# Altium project MasterProcessor.PrjPCB
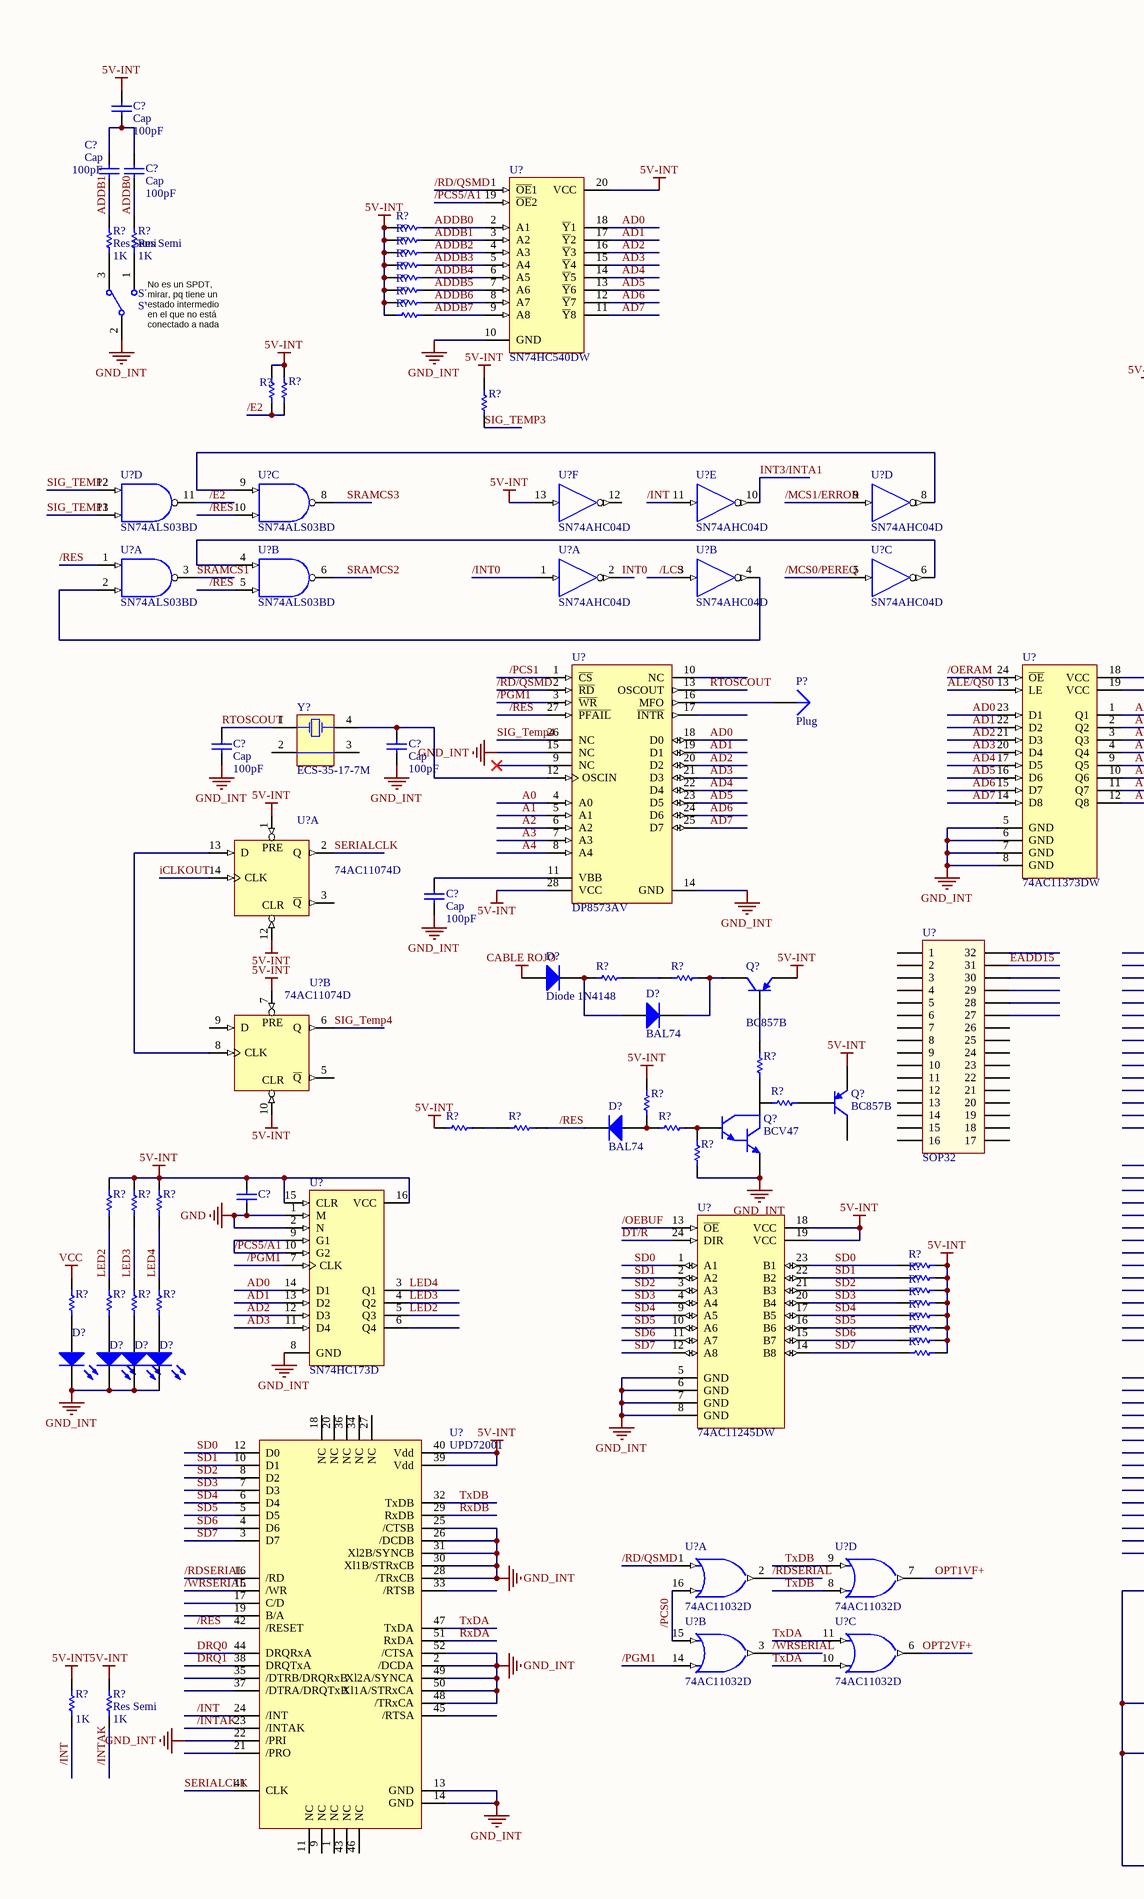
[diagram p0: Master_Processor.SchDoc, left]
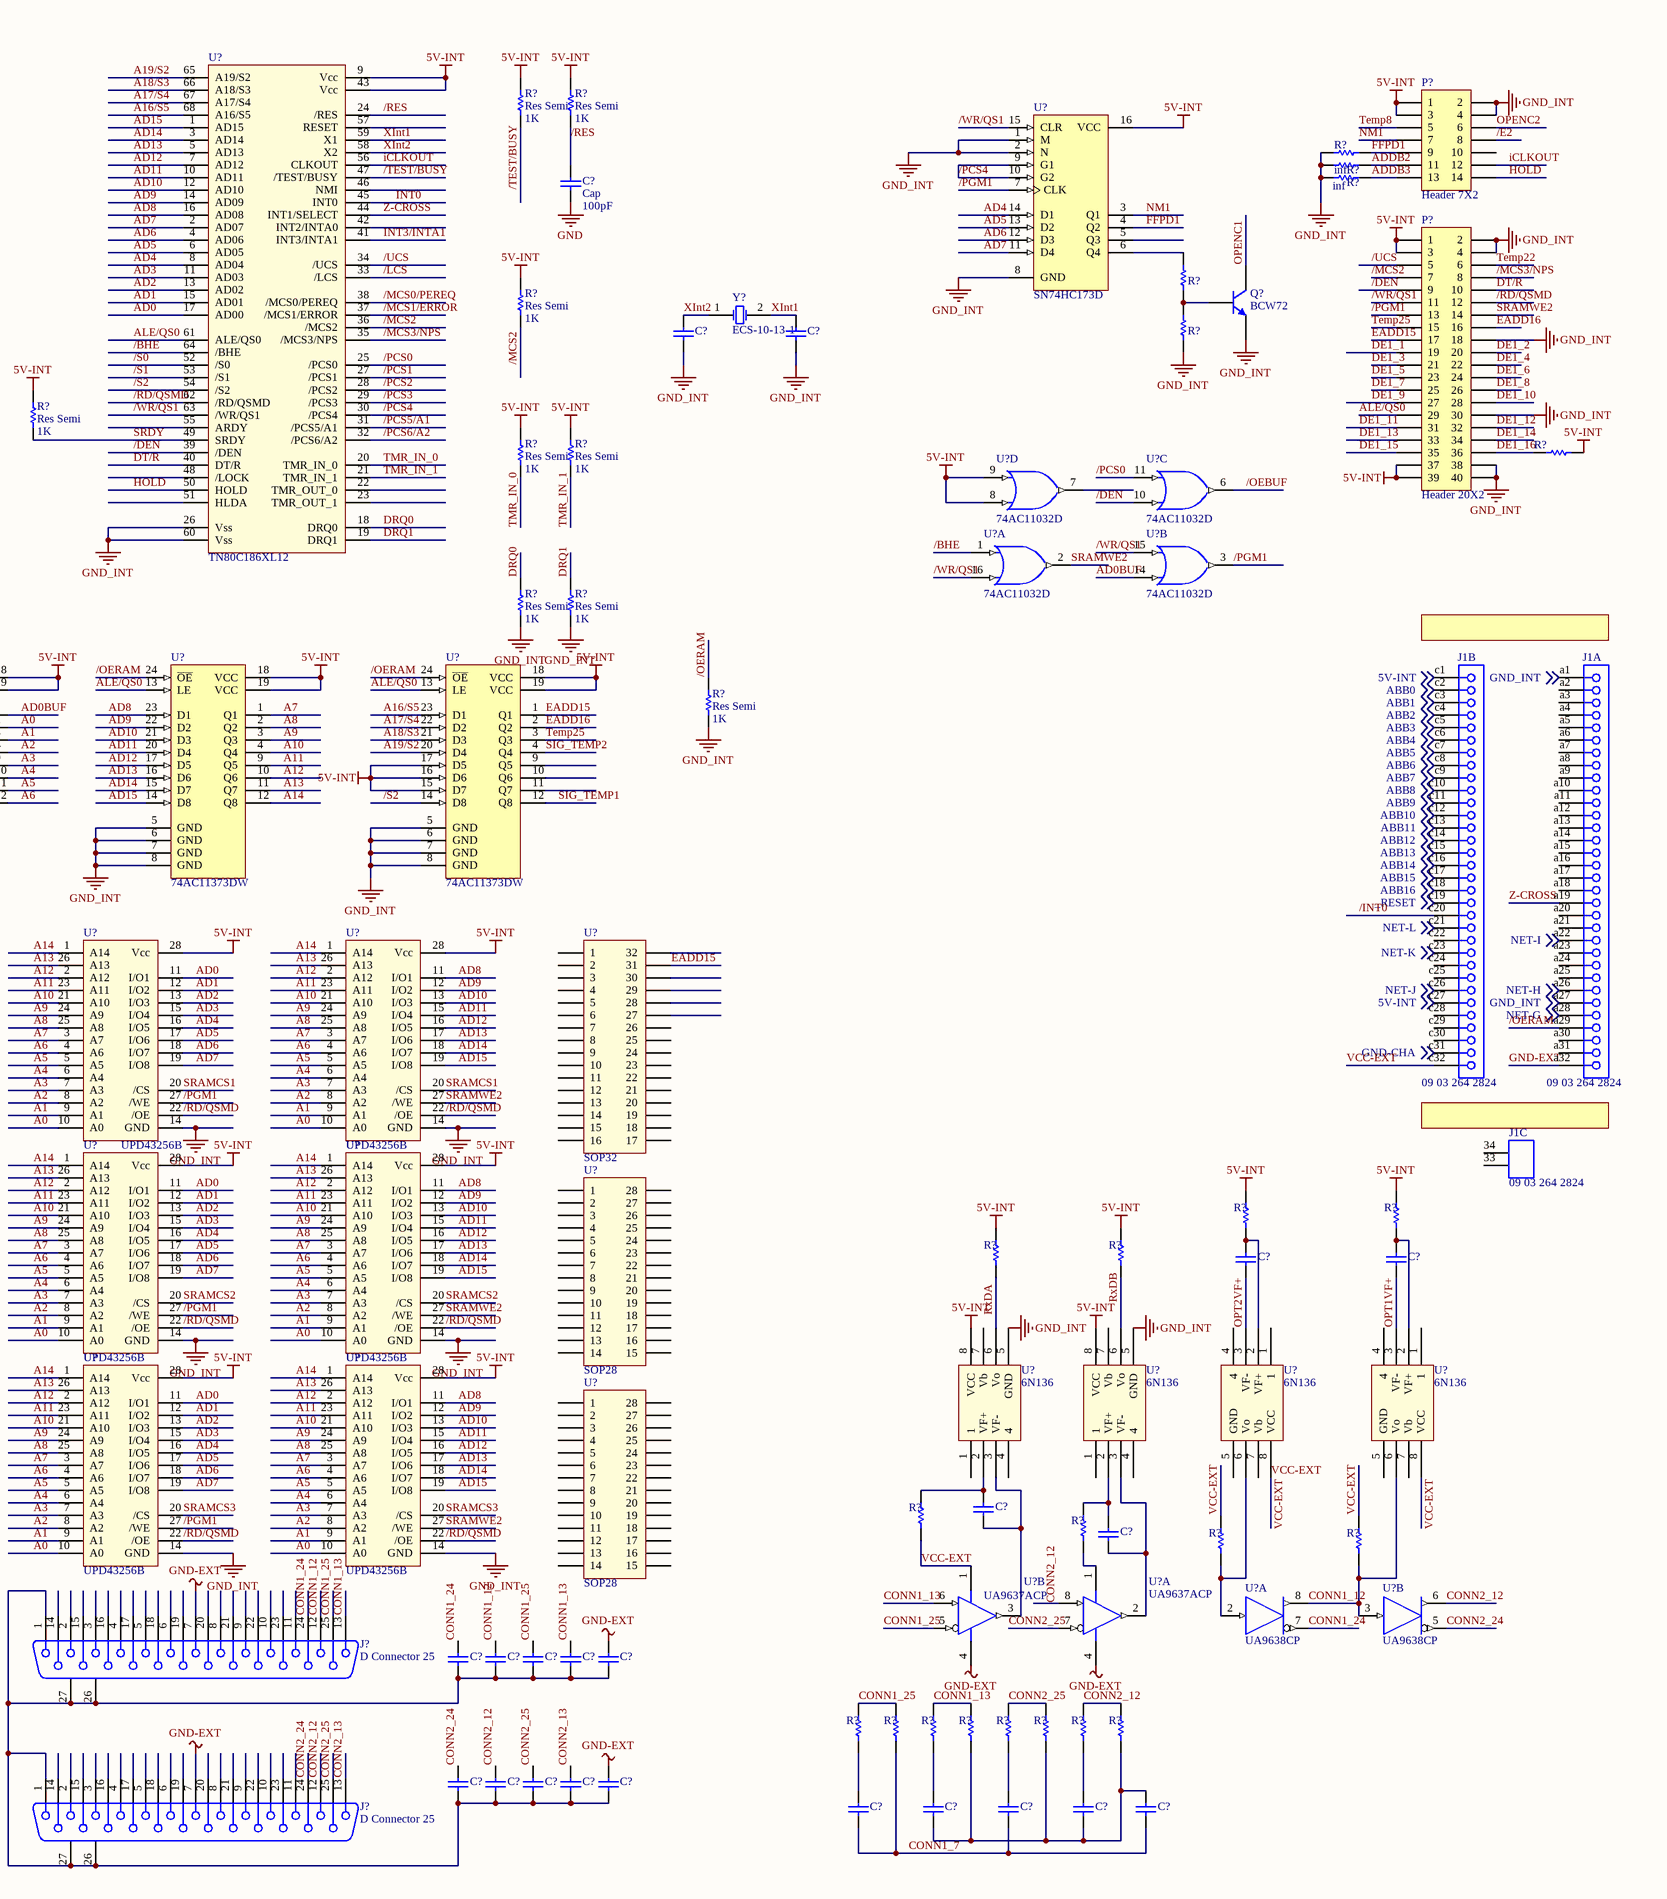
[diagram p1: Master_Processor.SchDoc, right]
1 sheet, 167 parts. Net scope: global (net labels, ports and power ports of the same name join across sheets).

## Sheet Master_Processor.SchDoc
size A2

### Parts
(Parts that share a designator on the sheet are numbered #1, #2 ... from top to bottom, then left to right.)
C?#1  Cap  value 100pF  [RAD-0.3]
C?#2  Cap  value 100pF  [RAD-0.3]
C?#3  Cap  value 100pF  [RAD-0.3]
C?#4  Cap  value 100pF  [RAD-0.3]
C?#5  Cap  [RAD-0.3]  (value not drawn)
C?#6  Cap  [RAD-0.3]  (value not drawn)
C?#7  Cap  value 100pF  [RAD-0.3]
C?#8  Cap  value 100pF  [RAD-0.3]
C?#9  Cap  value 100pF  [RAD-0.3]
C?#10  Cap  [RAD-0.3]  (value not drawn)
C?#11  Cap  [RAD-0.3]  (value not drawn)
C?#12  Cap  [RAD-0.3]  (value not drawn)
C?#13  Cap  [RAD-0.3]  (value not drawn)
C?#14  Cap  [RAD-0.3]  (value not drawn)
C?#15  Cap  [RAD-0.3]  (value not drawn)
C?#16  Cap  [RAD-0.3]  (value not drawn)
C?#17  Cap  [RAD-0.3]  (value not drawn)
C?#18  Cap  [RAD-0.3]  (value not drawn)
C?#19  Cap  [RAD-0.3]  (value not drawn)
C?#20  Cap  [RAD-0.3]  (value not drawn)
C?#21  Cap  [RAD-0.3]  (value not drawn)
C?#22  Cap  [RAD-0.3]  (value not drawn)
C?#23  Cap  [RAD-0.3]  (value not drawn)
C?#24  Cap  [RAD-0.3]  (value not drawn)
C?#25  Cap  [RAD-0.3]  (value not drawn)
C?#26  Cap  [RAD-0.3]  (value not drawn)
C?#27  Cap  [RAD-0.3]  (value not drawn)
C?#28  Cap  [RAD-0.3]  (value not drawn)
C?#29  Cap  [RAD-0.3]  (value not drawn)
D?#1  Diode 1N4148  [DO-35]
D?#2  BAL74  [SOT-23]
D?#3  BAL74  [SOT-23]
D?#4  LED0  [LED-0]  (value not drawn)
D?#5  LED0  [LED-0]  (value not drawn)
D?#6  LED0  [LED-0]  (value not drawn)
D?#7  LED0  [LED-0]  (value not drawn)
J1  09 03 264 2824  [0903264x824]  (parts A,B,C of 3)
J?#1  D Connector 25  [DSUB1.385-2H25A]
J?#2  D Connector 25  [DSUB1.385-2H25A]
P?#1  Header 7X2  [HDR2X7]
P?#2  Header 20X2  [HDR2X20]
P?#3  Plug  [PIN1]
Q?#1  BCW72  [SOT23]
Q?#2  BC857B  [SOT23_N]
Q?#3  BC857B  [SOT23_N]
Q?#4  BCV47  [SOT23_N]
R?#1  Res Semi  value 1K  [AXIAL-0.5]
R?#2  Res Semi  value 1K  [AXIAL-0.5]
R?#3  value inf  [RES0805]  (hidden comment: Res)
R?#4  value inf  [RES0805]  (hidden comment: Res)
R?#5  Res  [RES0805]  (value not drawn)
R?#6  Res Semi  [AXIAL-0.5]  (value not drawn)
R?#7  Res Semi  value 1K  [AXIAL-0.5]
R?#8  Res Semi  value 1K  [AXIAL-0.5]
R?#9  Res Semi  [AXIAL-0.5]  (value not drawn)
R?#10  Res Semi  [AXIAL-0.5]  (value not drawn)
R?#11  Res  [RES0805]  (value not drawn)
R?#12  Res Semi  [AXIAL-0.5]  (value not drawn)
R?#13  Res Semi  [AXIAL-0.5]  (value not drawn)
R?#14  Res Semi  [AXIAL-0.5]  (value not drawn)
R?#15  Res Semi  [AXIAL-0.5]  (value not drawn)
R?#16  Res Semi  value 1K  [AXIAL-0.5]
R?#17  Res  [RES0805]  (value not drawn)
R?#18  Res Semi  [AXIAL-0.5]  (value not drawn)
R?#19  Res Semi  [AXIAL-0.5]  (value not drawn)
R?#20  Res Semi  [AXIAL-0.5]  (value not drawn)
R?#21  Res Semi  [AXIAL-0.5]  (value not drawn)
R?#22  Res Semi  value 1K  [AXIAL-0.5]
R?#23  Res  [RES0805]  (value not drawn)
R?#24  Res Semi  value 1K  [AXIAL-0.5]
R?#25  Res Semi  value 1K  [AXIAL-0.5]
R?#26  Res Semi  value 1K  [AXIAL-0.5]
R?#27  Res Semi  value 1K  [AXIAL-0.5]
R?#28  Res Semi  value 1K  [AXIAL-0.5]
R?#29  Res Semi  [AXIAL-0.5]  (value not drawn)
R?#30  Res Semi  [AXIAL-0.5]  (value not drawn)
R?#31  Res Semi  [AXIAL-0.5]  (value not drawn)
R?#32  Res Semi  [AXIAL-0.5]  (value not drawn)
R?#33  Res Semi  [AXIAL-0.5]  (value not drawn)
R?#34  Res Semi  [AXIAL-0.5]  (value not drawn)
R?#35  Res Semi  [AXIAL-0.5]  (value not drawn)
R?#36  Res Semi  [AXIAL-0.5]  (value not drawn)
R?#37  Res Semi  [AXIAL-0.5]  (value not drawn)
R?#38  Res Semi  [AXIAL-0.5]  (value not drawn)
R?#39  Res Semi  [AXIAL-0.5]  (value not drawn)
R?#40  Res Semi  [AXIAL-0.5]  (value not drawn)
R?#41  Res Semi  [AXIAL-0.5]  (value not drawn)
R?#42  Res Semi  [AXIAL-0.5]  (value not drawn)
R?#43  Res Semi  [AXIAL-0.5]  (value not drawn)
R?#44  Res Semi  [AXIAL-0.5]  (value not drawn)
R?#45  Res Semi  [AXIAL-0.5]  (value not drawn)
R?#46  Res Semi  [AXIAL-0.5]  (value not drawn)
R?#47  Res Semi  [AXIAL-0.5]  (value not drawn)
R?#48  Res Semi  [AXIAL-0.5]  (value not drawn)
R?#49  Res Semi  [AXIAL-0.5]  (value not drawn)
R?#50  Res Semi  [AXIAL-0.5]  (value not drawn)
R?#51  Res Semi  [AXIAL-0.5]  (value not drawn)
R?#52  Res Semi  [AXIAL-0.5]  (value not drawn)
R?#53  Res Semi  [AXIAL-0.5]  (value not drawn)
R?#54  Res Semi  [AXIAL-0.5]  (value not drawn)
R?#55  Res Semi  [AXIAL-0.5]  (value not drawn)
R?#56  Res Semi  [AXIAL-0.5]  (value not drawn)
R?#57  Res Semi  [AXIAL-0.5]  (value not drawn)
R?#58  Res Semi  [AXIAL-0.5]  (value not drawn)
R?#59  Res Semi  [AXIAL-0.5]  (value not drawn)
R?#60  Res Semi  [AXIAL-0.5]  (value not drawn)
R?#61  value 1K  [AXIAL-0.5]  (hidden comment: Res Semi)
R?#62  Res Semi  value 1K  [AXIAL-0.5]
R?#63  Res Semi  [AXIAL-0.5]  (value not drawn)
R?#64  Res Semi  [AXIAL-0.5]  (value not drawn)
R?#65  Res Semi  [AXIAL-0.5]  (value not drawn)
R?#66  Res Semi  [AXIAL-0.5]  (value not drawn)
R?#67  Res Semi  [AXIAL-0.5]  (value not drawn)
R?#68  Res Semi  [AXIAL-0.5]  (value not drawn)
R?#69  Res Semi  [AXIAL-0.5]  (value not drawn)
R?#70  Res Semi  [AXIAL-0.5]  (value not drawn)
S?  SW-SPDT  [TL36WW15050]
U?#1  SN74HC173D  [D016_N]
U?#2  SN74HC540DW  [DW020_N]
U?#3  TN80C186XL12
U?#4  74AC11032D  [D016_N]  (part D of 4)
U?#5  74AC11032D  [D016_N]  (part C of 4)
U?#6  SN74ALS03BD  [D014_N]  (part D of 4)
U?#7  SN74ALS03BD  [D014_N]  (part C of 4)
U?#8  SN74AHC04D  [D014_N]  (part F of 6)
U?#9  SN74AHC04D  [D014_N]  (part E of 6)
U?#10  SN74AHC04D  [D014_N]  (part D of 6)
U?#11  74AC11032D  [D016_N]  (part A of 4)
U?#12  74AC11032D  [D016_N]  (part B of 4)
U?#13  SN74ALS03BD  [D014_N]  (part A of 4)
U?#14  SN74ALS03BD  [D014_N]  (part B of 4)
U?#15  SN74AHC04D  [D014_N]  (part A of 6)
U?#16  SN74AHC04D  [D014_N]  (part B of 6)
U?#17  SN74AHC04D  [D014_N]  (part C of 6)
U?#18  DP8573AV  [V28A_L]
U?#19  74AC11373DW  [DW024_N]
U?#20  74AC11373DW  [DW024_N]
U?#21  74AC11373DW  [DW024_N]
U?#22  74AC11074D  [D014_N]  (part A of 2)
U?#23  SOP32
U?#24  UPD43256B
U?#25  UPD43256B
U?#26  SOP32
U?#27  74AC11074D  [D014_N]  (part B of 2)
U?#28  UPD43256B
U?#29  UPD43256B
U?#30  SN74HC173D  [D016_N]
U?#31  SOP28
U?#32  74AC11245DW  [DW024_N]
U?#33  6N136
U?#34  6N136
U?#35  UPD43256B
U?#36  UPD43256B
U?#37  SOP28
U?#38  6N136
U?#39  6N136
U?#40  74AC11032D  [D016_N]  (part A of 4)
U?#41  74AC11032D  [D016_N]  (part D of 4)
U?#42  UA9637ACP  [P008]  (part B of 2)
U?#43  UA9637ACP  [P008]  (part A of 2)
U?#44  UA9638CP  [P008]  (part A of 2)
U?#45  UA9638CP  [P008]  (part B of 2)
U?#46  UPD72001
U?#47  74AC11032D  [D016_N]  (part B of 4)
U?#48  74AC11032D  [D016_N]  (part C of 4)
Y?#1  ECS-10-13-1  [HC-49U]
Y?#2  ECS-35-17-7M  [ECX-3M]

### Nets
5V-INT: C?#1.2 C?#10.2 J1.c1 J1.c27 P?#1.1 P?#1.3 P?#2.1 P?#2.3 P?#2.37 P?#2.39 Q?#2.2(E) Q?#3.2(E) R?#1.2 R?#2.2 R?#6.2 R?#9.2 R?#10.2 R?#12.2 R?#13.2 R?#14.2 R?#15.2 R?#16.2 R?#18.2 R?#19.2 R?#20.2 R?#21.2 R?#22.2 R?#23.2 R?#24.2 R?#25.2 R?#32.1 R?#35.2 R?#38.2 R?#39.2 R?#40.2 R?#41.2 R?#42.2 R?#43.2 R?#44.2 R?#45.1 R?#46.1 R?#47.1 R?#52.1 R?#53.1 R?#54.1 R?#55.1 R?#56.1 R?#61.2 R?#62.2 U?#1.16(VCC) U?#2.20(VCC) U?#3.9(Vcc) U?#3.43(Vcc) U?#4.8(B) U?#4.9(A) U?#8.13(A) U?#18.28(VCC) U?#19.18(VCC) U?#19.19(VCC) U?#20.18(VCC) U?#20.19(VCC) U?#21.15(D7) U?#21.16(D6) U?#21.17(D5) U?#21.18(VCC) U?#21.19(VCC) U?#22.1(PRE) U?#22.12(CLR) U?#24.28(Vcc) U?#25.28(Vcc) U?#27.7(PRE) U?#27.10(CLR) U?#28.28(Vcc) U?#29.28(Vcc) U?#30.15(CLR) U?#30.16(VCC) U?#32.18(VCC) U?#32.19(VCC) U?#35.28(Vcc) U?#36.28(Vcc) U?#38.8(VCC) U?#39.8(VCC) U?#46.39(Vdd) U?#46.40(Vdd) ; off-sheet 5V-INT
CABLE ROJO: D?#1.1(A)
GND: C?#4.2 C?#10.1 U?#4.4(GND) U?#4.5(GND) U?#5.4(GND) U?#5.5(GND) U?#6.7(GND) U?#7.7(GND) U?#8.7(GND) U?#9.7(GND) U?#10.7(GND) U?#11.4(GND) U?#11.5(GND) U?#12.4(GND) U?#12.5(GND) U?#13.7(GND) U?#14.7(GND) U?#15.7(GND) U?#16.7(GND) U?#17.7(GND) U?#22.4(GND) U?#27.4(GND) U?#30.1(M) U?#30.2(N) U?#40.4(GND) U?#40.5(GND) U?#41.4(GND) U?#41.5(GND) U?#44.4(GND) U?#45.4(GND) U?#47.4(GND) U?#47.5(GND) U?#48.4(GND) U?#48.5(GND)
GND-EXT: C?#19.2 C?#24.2 J1.a32 J?#1.7 J?#2.7 U?#42.4(GND) U?#43.4(GND)
GND_INT: C?#5.1 C?#6.1 C?#7.2 C?#8.2 C?#9.2 D?#4.2(K) D?#5.2(K) D?#6.2(K) D?#7.2(K) J1.a1 J1.a27 P?#1.2 P?#1.4 P?#2.2 P?#2.4 P?#2.18 P?#2.30 P?#2.38 P?#2.40 Q?#1.2(E) Q?#4.2(E) R?#3.1 R?#4.1 R?#5.2 R?#17.2 R?#26.1 R?#27.1 R?#28.1 R?#37.1 S?.2 U?#1.1(M) U?#1.2(N) U?#1.8(GND) U?#2.10(GND) U?#3.26(Vss) U?#3.60(Vss) U?#18.14(GND) U?#18.15(NC) U?#19.5(GND) U?#19.6(GND) U?#19.7(GND) U?#19.8(GND) U?#20.5(GND) U?#20.6(GND) U?#20.7(GND) U?#20.8(GND) U?#21.5(GND) U?#21.6(GND) U?#21.7(GND) U?#21.8(GND) U?#24.14(GND) U?#25.14(GND) U?#28.14(GND) U?#29.14(GND) U?#30.8(GND) U?#32.5(GND) U?#32.6(GND) U?#32.7(GND) U?#32.8(GND) U?#35.14(GND) U?#36.14(GND) U?#38.5(GND) U?#39.5(GND) U?#46.2(/DCDA) U?#46.13(GND) U?#46.14(GND) U?#46.22(/PRI) U?#46.25(/CTSB) U?#46.26(/DCDB) U?#46.28(/TRxCB) U?#46.30(Xl1B/STRxCB) U?#46.31(Xl2B/SYNCB) U?#46.48(/TRxCA) U?#46.49(Xl2A/SYNCA) U?#46.50(Xl1A/STRxCA) U?#46.52(/CTSA) ; off-sheet GND_INT
VCC: R?#48.2 U?#4.12(VCC) U?#4.13(VCC) U?#5.12(VCC) U?#5.13(VCC) U?#6.14(VCC) U?#7.14(VCC) U?#8.14(VCC) U?#9.14(VCC) U?#10.14(VCC) U?#11.12(VCC) U?#11.13(VCC) U?#12.12(VCC) U?#12.13(VCC) U?#13.14(VCC) U?#14.14(VCC) U?#15.14(VCC) U?#16.14(VCC) U?#17.14(VCC) U?#22.11(VCC) U?#27.11(VCC) U?#40.12(VCC) U?#40.13(VCC) U?#41.12(VCC) U?#41.13(VCC) U?#44.1(VCC) U?#45.1(VCC) U?#47.12(VCC) U?#47.13(VCC) U?#48.12(VCC) U?#48.13(VCC)
/BHE: U?#3.64(/BHE) U?#11.1(A)
/DEN: P?#2.9 U?#3.39(/DEN) U?#5.10(B)
/E2: P?#1.8 R?#19.1 R?#20.1 U?#6.11(Y)
/INT: R?#61.1 U?#9.11(A) U?#46.24(/INT)
/INT0: J1.c20 U?#15.1(A)
/INTAK: R?#62.1 U?#46.23(/INTAK)
/LCS: U?#3.33(/LCS) U?#16.3(A)
/MCS0/PEREQ: U?#3.38(/MCS0/PEREQ) U?#17.5(A)
/MCS1/ERROR: U?#3.37(/MCS1/ERROR) U?#10.9(A)
/MCS2: P?#2.7 R?#16.1 U?#3.36(/MCS2)
/MCS3/NPS: P?#2.8 U?#3.35(/MCS3/NPS)
/OEBUF: U?#5.6(Y) U?#32.13(~{OE})
/OERAM: J1.a29 R?#28.2 U?#19.24(~{OE}) U?#20.24(~{OE}) U?#21.24(~{OE})
/PCS0: U?#3.25(/PCS0) U?#5.11(A) U?#40.16(B) U?#47.15(A)
/PCS1: U?#3.27(/PCS1) U?#18.1(~{CS})
/PCS2: U?#3.28(/PCS2)
/PCS3: U?#3.29(/PCS3)
/PCS4: U?#1.9(G1) U?#1.10(G2) U?#3.30(/PCS4)
/PCS5/A1: U?#2.19(~{OE}2) U?#3.31(/PCS5/A1) U?#30.9(G1) U?#30.10(G2)
/PCS6/A2: U?#3.32(/PCS6/A2)
/PGM1: P?#2.13 U?#1.7(CLK) U?#12.3(Y) U?#18.3(~{WR}) U?#24.27(/WE) U?#28.27(/WE) U?#30.7(CLK) U?#35.27(/WE) U?#47.14(B)
/RD/QSMD: P?#2.12 U?#2.1(~{OE}1) U?#3.62(/RD/QSMD) U?#18.2(~{RD}) U?#24.22(/OE) U?#25.22(/OE) U?#28.22(/OE) U?#29.22(/OE) U?#35.22(/OE) U?#36.22(/OE) U?#40.1(A)
/RDSERIAL: U?#40.2(Y) U?#46.16(/RD)
/RES: C?#4.1 D?#3.3(K) R?#2.1 R?#36.1 U?#3.24(/RES) U?#7.10(B) U?#13.1(A) U?#14.5(B) U?#18.27(~{PFAIL}) U?#46.42(/RESET)
/S0: U?#3.52(/S0)
/S1: U?#3.53(/S1)
/S2: U?#3.54(/S2) U?#21.14(D8)
/TEST/BUSY: R?#1.1 U?#3.47(/TEST/BUSY)
/UCS: P?#2.5 U?#3.34(/UCS)
/WR/QS1: P?#2.11 U?#1.15(CLR) U?#3.63(/WR/QS1) U?#11.16(B) U?#12.15(A)
/WRSERIAL: U?#46.15(/WR) U?#47.3(Y)
_RESET: J1.c19 ; off-sheet _RESET
A0: U?#18.4(A0) U?#19.2(Q2) U?#24.10(A0) U?#25.10(A0) U?#28.10(A0) U?#29.10(A0) U?#35.10(A0) U?#36.10(A0)
A1: U?#18.5(A1) U?#19.3(Q3) U?#24.9(A1) U?#25.9(A1) U?#28.9(A1) U?#29.9(A1) U?#35.9(A1) U?#36.9(A1)
A2: U?#18.6(A2) U?#19.4(Q4) U?#24.8(A2) U?#25.8(A2) U?#28.8(A2) U?#29.8(A2) U?#35.8(A2) U?#36.8(A2)
A3: U?#18.7(A3) U?#19.9(Q5) U?#24.7(A3) U?#25.7(A3) U?#28.7(A3) U?#29.7(A3) U?#35.7(A3) U?#36.7(A3)
A4: U?#18.8(A4) U?#19.10(Q6) U?#24.6(A4) U?#25.6(A4) U?#28.6(A4) U?#29.6(A4) U?#35.6(A4) U?#36.6(A4)
A5: U?#19.11(Q7) U?#24.5(A5) U?#25.5(A5) U?#28.5(A5) U?#29.5(A5) U?#35.5(A5) U?#36.5(A5)
A6: U?#19.12(Q8) U?#24.4(A6) U?#25.4(A6) U?#28.4(A6) U?#29.4(A6) U?#35.4(A6) U?#36.4(A6)
A7: U?#20.1(Q1) U?#24.3(A7) U?#25.3(A7) U?#28.3(A7) U?#29.3(A7) U?#35.3(A7) U?#36.3(A7)
A8: U?#20.2(Q2) U?#24.25(A8) U?#25.25(A8) U?#28.25(A8) U?#29.25(A8) U?#35.25(A8) U?#36.25(A8)
A9: U?#20.3(Q3) U?#24.24(A9) U?#25.24(A9) U?#28.24(A9) U?#29.24(A9) U?#35.24(A9) U?#36.24(A9)
A10: U?#20.4(Q4) U?#24.21(A10) U?#25.21(A10) U?#28.21(A10) U?#29.21(A10) U?#35.21(A10) U?#36.21(A10)
A11: U?#20.9(Q5) U?#24.23(A11) U?#25.23(A11) U?#28.23(A11) U?#29.23(A11) U?#35.23(A11) U?#36.23(A11)
A12: U?#20.10(Q6) U?#24.2(A12) U?#25.2(A12) U?#28.2(A12) U?#29.2(A12) U?#35.2(A12) U?#36.2(A12)
A13: U?#20.11(Q7) U?#24.26(A13) U?#25.26(A13) U?#28.26(A13) U?#29.26(A13) U?#35.26(A13) U?#36.26(A13)
A14: U?#20.12(Q8) U?#24.1(A14) U?#25.1(A14) U?#28.1(A14) U?#29.1(A14) U?#35.1(A14) U?#36.1(A14)
A16/S5: U?#3.68(A16/S5) U?#21.23(D1)
A17/S4: U?#3.67(A17/S4) U?#21.22(D2)
A18/S3: U?#3.66(A18/S3) U?#21.21(D3)
A19/S2: U?#3.65(A19/S2) U?#21.20(D4)
ABB0: J1.c2 ; off-sheet ABB0
ABB1: J1.c3 ; off-sheet ABB1
ABB2: J1.c4 ; off-sheet ABB2
ABB3: J1.c5 ; off-sheet ABB3
ABB4: J1.c6 ; off-sheet ABB4
ABB5: J1.c7 ; off-sheet ABB5
ABB6: J1.c8 ; off-sheet ABB6
ABB7: J1.c9 ; off-sheet ABB7
ABB8: J1.c10 ; off-sheet ABB8
ABB9: J1.c11 ; off-sheet ABB9
ABB10: J1.c12 ; off-sheet ABB10
ABB11: J1.c13 ; off-sheet ABB11
ABB12: J1.c14 ; off-sheet ABB12
ABB13: J1.c15 ; off-sheet ABB13
ABB14: J1.c16 ; off-sheet ABB14
ABB15: J1.c17 ; off-sheet ABB15
ABB16: J1.c18 ; off-sheet ABB16
AD0: U?#2.18(~{Y}1) U?#3.17(AD00) U?#18.18(D0) U?#19.23(D1) U?#24.11(I/O1) U?#28.11(I/O1) U?#30.14(D1) U?#35.11(I/O1)
AD0BUF: U?#12.14(B) U?#19.1(Q1)
AD1: U?#2.17(~{Y}2) U?#3.15(AD01) U?#18.19(D1) U?#19.22(D2) U?#24.12(I/O2) U?#28.12(I/O2) U?#30.13(D2) U?#35.12(I/O2)
AD2: U?#2.16(~{Y}3) U?#3.13(AD02) U?#18.20(D2) U?#19.21(D3) U?#24.13(I/O3) U?#28.13(I/O3) U?#30.12(D3) U?#35.13(I/O3)
AD3: U?#2.15(~{Y}4) U?#3.11(AD03) U?#18.21(D3) U?#19.20(D4) U?#24.15(I/O4) U?#28.15(I/O4) U?#30.11(D4) U?#35.15(I/O4)
AD4: U?#1.14(D1) U?#2.14(~{Y}5) U?#3.8(AD04) U?#18.22(D4) U?#19.17(D5) U?#24.16(I/O5) U?#28.16(I/O5) U?#35.16(I/O5)
AD5: U?#1.13(D2) U?#2.13(~{Y}6) U?#3.6(AD05) U?#18.23(D5) U?#19.16(D6) U?#24.17(I/O6) U?#28.17(I/O6) U?#35.17(I/O6)
AD6: U?#1.12(D3) U?#2.12(~{Y}7) U?#3.4(AD06) U?#18.24(D6) U?#19.15(D7) U?#24.18(I/O7) U?#28.18(I/O7) U?#35.18(I/O7)
AD7: U?#1.11(D4) U?#2.11(~{Y}8) U?#3.2(AD07) U?#18.25(D7) U?#19.14(D8) U?#24.19(I/O8) U?#28.19(I/O8) U?#35.19(I/O8)
AD8: U?#3.16(AD08) U?#20.23(D1) U?#25.11(I/O1) U?#29.11(I/O1) U?#36.11(I/O1)
AD9: U?#3.14(AD09) U?#20.22(D2) U?#25.12(I/O2) U?#29.12(I/O2) U?#36.12(I/O2)
AD10: U?#3.12(AD10) U?#20.21(D3) U?#25.13(I/O3) U?#29.13(I/O3) U?#36.13(I/O3)
AD11: U?#3.10(AD11) U?#20.20(D4) U?#25.15(I/O4) U?#29.15(I/O4) U?#36.15(I/O4)
AD12: U?#3.7(AD12) U?#20.17(D5) U?#25.16(I/O5) U?#29.16(I/O5) U?#36.16(I/O5)
AD13: U?#3.5(AD13) U?#20.16(D6) U?#25.17(I/O6) U?#29.17(I/O6) U?#36.17(I/O6)
AD14: U?#3.3(AD14) U?#20.15(D7) U?#25.18(I/O7) U?#29.18(I/O7) U?#36.18(I/O7)
AD15: U?#3.1(AD15) U?#20.14(D8) U?#25.19(I/O8) U?#29.19(I/O8) U?#36.19(I/O8)
ADDB0: C?#3.2 R?#6.1 R?#8.2 U?#2.2(A1)
ADDB1: C?#2.2 R?#7.2 R?#9.1 U?#2.3(A2)
ADDB2: P?#1.11 R?#3.2 R?#10.1 U?#2.4(A3)
ADDB3: P?#1.13 R?#4.2 R?#12.1 U?#2.5(A4)
ADDB4: R?#13.1 U?#2.6(A5)
ADDB5: R?#14.1 U?#2.7(A6)
ADDB6: R?#15.1 U?#2.8(A7)
ADDB7: R?#18.1 U?#2.9(A8)
ALE/QS0: P?#2.29 U?#3.61(ALE/QS0) U?#19.13(LE) U?#20.13(LE) U?#21.13(LE)
CONN1_7: C?#25.1 C?#27.1 C?#29.1 R?#64.1
CONN1_12: C?#16.2 J?#1.12 R?#60.1 U?#34.6(Vo) U?#44.8(1Y) U?#45.3(2A)
CONN1_13: C?#18.2 J?#1.13 R?#65.2 R?#66.2 U?#42.6(2IN+)
CONN1_24: C?#15.2 J?#1.24 U?#44.7(1Z)
CONN1_25: C?#17.2 J?#1.25 R?#63.2 R?#64.2 U?#42.5(2IN-)
CONN2_12: C?#21.2 J?#2.12 R?#69.2 R?#70.2 U?#43.8(1IN+) U?#45.6(2Y)
CONN2_13: C?#23.2 J?#2.13
CONN2_24: C?#20.2 J?#2.24 U?#45.5(2Z)
CONN2_25: C?#22.2 J?#2.25 R?#67.2 R?#68.2 U?#43.7(1IN-)
DE1_1: P?#2.19
DE1_2: P?#2.20
DE1_3: P?#2.21
DE1_4: P?#2.22
DE1_5: P?#2.23
DE1_6: P?#2.24
DE1_7: P?#2.25
DE1_8: P?#2.26
DE1_9: P?#2.27
DE1_10: P?#2.28
DE1_11: P?#2.31
DE1_12: P?#2.32
DE1_13: P?#2.33
DE1_14: P?#2.34
DE1_15: P?#2.35
DE1_16: P?#2.36 R?#23.1
DRQ0: R?#26.2 U?#3.18(DRQ0) U?#46.44(DRQRxA)
DRQ1: R?#27.2 U?#3.19(DRQ1) U?#46.38(DRQTxA)
DT/R: P?#2.10 U?#3.40(DT/R) U?#32.24(DIR)
EADD15: P?#2.17 U?#21.1(Q1) U?#23.31 U?#26.31
EADD16: P?#2.16 U?#21.2(Q2)
FFPD1: P?#1.9 R?#5.1 U?#1.4(Q2)
GND-CHA: J1.c31 ; off-sheet GND-CHA
HOLD: P?#1.14 U?#3.50(HOLD)
iCLKOUT: P?#1.12 U?#3.56(CLKOUT) U?#22.14(CLK)
INT0: U?#3.45(INT0) U?#15.2(Y)
INT3/INTA1: U?#3.41(INT3/INTA1) U?#9.10(Y)
LED2: R?#38.1 R?#49.2 U?#30.5(Q3)
LED3: R?#39.1 R?#50.2 U?#30.4(Q2)
LED4: R?#40.1 R?#51.2 U?#30.3(Q1)
NET-G: J1.a28 ; off-sheet NET-G
NET-H: J1.a26 ; off-sheet NET-H
NET-I: J1.a22 ; off-sheet NET-I
NET-J: J1.c26 ; off-sheet NET-J
NET-K: J1.c23 ; off-sheet NET-K
NET-L: J1.c21 ; off-sheet NET-L
NM1: P?#1.7 U?#1.3(Q1)
OPENC1: Q?#1.1(C)
OPENC2: P?#1.6
OPT1VF+: C?#12.1 U?#34.3(VF-) U?#41.7(Y)
OPT2VF+: C?#11.1 U?#33.3(VF-) U?#48.6(Y)
RTOSCOUT: C?#7.1 U?#18.13(OSCOUT) Y?#2.1(OSC1)
RxDA: R?#43.1 U?#38.6(Vo) U?#46.51(RxDA)
RxDB: R?#44.1 U?#39.6(Vo) U?#46.29(RxDB)
SD0: R?#45.2 U?#32.1(A1) U?#32.23(B1) U?#46.12(D0)
SD1: R?#46.2 U?#32.2(A2) U?#32.22(B2) U?#46.10(D1)
SD2: R?#47.2 U?#32.3(A3) U?#32.21(B3) U?#46.8(D2)
SD3: R?#52.2 U?#32.4(A4) U?#32.20(B4) U?#46.7(D3)
SD4: R?#53.2 U?#32.9(A5) U?#32.17(B5) U?#46.6(D4)
SD5: R?#54.2 U?#32.10(A6) U?#32.16(B6) U?#46.5(D5)
SD6: R?#55.2 U?#32.11(A7) U?#32.15(B7) U?#46.4(D6)
SD7: R?#56.2 U?#32.12(A8) U?#32.14(B8) U?#46.3(D7)
SERIALCLK: U?#22.2(Q) U?#46.41(CLK)
SIG_TEMP1: U?#6.13(B) U?#21.12(Q8)
SIG_TEMP2: U?#6.12(A) U?#21.4(Q4)
SIG_TEMP3: R?#21.1
SIG_Temp4: U?#18.26(NC) U?#27.6(Q)
SRAMCS1: U?#13.3(Y) U?#24.20(/CS) U?#25.20(/CS)
SRAMCS2: U?#14.6(Y) U?#28.20(/CS) U?#29.20(/CS)
SRAMCS3: U?#7.8(Y) U?#35.20(/CS) U?#36.20(/CS)
SRAMWE2: P?#2.14 U?#11.2(Y) U?#25.27(/WE) U?#29.27(/WE) U?#36.27(/WE)
SRDY: R?#22.1 U?#3.49(SRDY)
Temp8: P?#1.5
Temp22: P?#2.6
Temp25: P?#2.15 U?#21.3(Q3)
TMR_IN_0: R?#24.1 U?#3.20(TMR_IN_0)
TMR_IN_1: R?#25.1 U?#3.21(TMR_IN_1)
TxDA: U?#46.47(TxDA) U?#48.10(B) U?#48.11(A)
TxDB: U?#41.8(B) U?#41.9(A) U?#46.32(TxDB)
VCC-EXT: J1.c32 R?#57.1 R?#59.2 R?#60.2 U?#33.8(VCC) U?#34.8(VCC) U?#42.1(VCC)
XInt1: C?#6.2 U?#3.59(X1) Y?#1.2(OSC2)
XInt2: C?#5.2 U?#3.58(X2) Y?#1.1(OSC1)
Z-CROSS: J1.a19 U?#3.44(INT1/SELECT)
NetC?#1_1: C?#1.1 C?#2.1 C?#3.1
NetC?#8_1: C?#8.1 U?#18.12(OSCIN) Y?#2.4(OSC2)
NetC?#9_1: C?#9.1 U?#18.11(VBB)
NetC?#11_2: C?#11.2 R?#41.1 U?#33.2(VF+)
NetC?#12_2: C?#12.2 R?#42.1 U?#34.2(VF+)
NetC?#13_1: C?#13.1 U?#38.3(VF-) U?#42.3(2OUT)
NetC?#13_2: C?#13.2 R?#57.2 U?#38.2(VF+)
NetC?#14_1: C?#14.1 U?#39.3(VF-) U?#43.2(1OUT)
NetC?#14_2: C?#14.2 R?#58.2 U?#39.2(VF+)
NetC?#15_1: C?#15.1 C?#16.1 C?#17.1 C?#18.1 C?#19.1 C?#20.1 C?#21.1 C?#22.1 C?#23.1 C?#24.1 J?#1.1 J?#1.26(MH1) J?#1.27(MH2) J?#2.1 J?#2.26(MH1) J?#2.27(MH2)
NetC?#25_2: C?#25.2 R?#63.1
NetC?#26_1: C?#26.1 C?#28.1 C?#29.2 R?#66.1 R?#68.1 R?#70.1
NetC?#26_2: C?#26.2 R?#65.1
NetC?#27_2: C?#27.2 R?#67.1
NetC?#28_2: C?#28.2 R?#69.1
NetD?#1_2: D?#1.2(K) D?#2.2(A) R?#29.2
NetD?#2_3: D?#2.3(K) Q?#2.3(C) R?#30.1
NetD?#3_2: D?#3.2(A) R?#32.2 R?#33.1
NetD?#4_1: D?#4.1(A) R?#48.1
NetD?#5_1: D?#5.1(A) R?#49.1
NetD?#6_1: D?#6.1(A) R?#50.1
NetD?#7_1: D?#7.1(A) R?#51.1
NetP?#3_1: P?#3.1 U?#18.16(MFO)
NetQ?#1_3: Q?#1.3(B) R?#11.2 R?#17.1
NetQ?#2_1: Q?#2.1(B) R?#31.2
NetQ?#3_1: Q?#3.1(B) R?#34.1
NetQ?#4_1: Q?#4.1(B) R?#33.2 R?#37.2
NetQ?#4_3: Q?#4.3(C) R?#31.1
NetR?#7_1: R?#7.1 S?.3
NetR?#8_1: R?#8.1 S?.1
NetR?#11_1: R?#11.1 U?#1.6(Q4)
NetR?#29_1: R?#29.1 R?#30.2
NetR?#35_1: R?#35.1 R?#36.2
NetR?#58_1: R?#58.1 U?#43.1(VCC)
NetR?#59_1: R?#59.1 U?#33.6(Vo) U?#44.2(1A)
NetU?#7_9: U?#7.9(A) U?#10.8(Y)
NetU?#13_2: U?#13.2(B) U?#16.4(Y)
NetU?#14_4: U?#14.4(A) U?#17.6(Y)
NetU?#22_13: U?#22.13(D) U?#27.8(CLK)

Not connected (* = marked no-connect by the designer): J1 33(MH1) 34(MH2) a2 a3 a4 a5 a6 a7 a8 a9 a10 a11 a12 a13 a14 a15 a16 a17 a18 a20 a21 a23 a24 a25 a30 a31 c22 c24 c25 c28 c29 c30; J?#1 2 3 4 5 6 8 9 10 11 14 15 16 17 18 19 20 21 22 23; J?#2 2 3 4 5 6 8 9 10 11 14 15 16 17 18 19 20 21 22 23; P?#1 10; Q?#3 3(C); R?#34 2; U?#1 5(Q3); U?#3 22(TMR_OUT_0) 23(TMR_OUT_1) 42(INT2/INTA0) 46(NMI) 48(/LOCK) 51(HLDA) 55(ARDY) 57(RESET); U?#4 7(Y); U?#8 12(Y); U?#18 9(NC)* 10(NC) 17(~{INTR}); U?#21 9(Q5) 10(Q6) 11(Q7); U?#22 3(~{Q}); U?#23 1 2 3 4 5 6 7 8 9 10 11 12 13 14 15 16 17 18 19 20 21 22 23 24 25 26 27 28 29 30 32; U?#26 1 2 3 4 5 6 7 8 9 10 11 12 13 14 15 16 17 18 19 20 21 22 23 24 25 26 27 28 29 30 32; U?#27 5(~{Q}) 9(D); U?#30 6(Q4); U?#31 1 2 3 4 5 6 7 8 9 10 11 12 13 14 15 16 17 18 19 20 21 22 23 24 25 26 27 28; U?#33 1 4 5(GND) 7(Vb); U?#34 1 4 5(GND) 7(Vb); U?#37 1 2 3 4 5 6 7 8 9 10 11 12 13 14 15 16 17 18 19 20 21 22 23 24 25 26 27 28; U?#38 1 4 7(Vb); U?#39 1 4 7(Vb); U?#46 1(NC) 9(NC) 11(NC) 17(C/D) 18(NC) 19(B/A) 20(NC) 21(/PRO) 27(NC) 33(/RTSB) 34(NC) 35(/DTRB/DRQRxB) 36(NC) 37(/DTRA/DRQTxB) 43(NC) 45(/RTSA) 46(NC); Y?#2 2(COM) 3(COM)

### Notes on the sheet
- (near S?) No es un SPDT,
  mirar, pq tiene un estado intermedio
  en el que no está conectado a nada

### Library data of the parts
C?#1-C?#4 C?#7-C?#9 = Cap: Capacitor; Published: 8-Jun-2000; LatestRevisionDate: 17-Jul-2002; LatestRevisionNote: Re-released for DXP Platform.; PackageReference: RAD-0.3; Publisher: Altium Limited
C?#5 C?#6 C?#10-C?#29 = Cap: Capacitor; Value: 100pF; Published: 8-Jun-2000; LatestRevisionDate: 17-Jul-2002; LatestRevisionNote: Re-released for DXP Platform.; PackageReference: RAD-0.3; Publisher: Altium Limited
D?#1 = Diode 1N4148: High Conductance Fast Diode; Published: 8-Jun-2000; LatestRevisionDate: 17-Jul-2002; LatestRevisionNote: Re-released for DXP Platform.; DatasheetDocument: 1997; PackageReference: DO-35; Publisher: Altium Limited; Code_JEDEC: DO-204-AH; ComponentLink1Description: Manufacturer Link; ComponentLink1URL: http://www.fairchildsemi.com/; ComponentLink2Description: Datasheet; ComponentLink2URL: http://www.fairchildsemi.com/ds/1N%2F1N4148.pdf
D?#2 D?#3 = BAL74: Silicon Switching Diode for High-Speed Switching; Note: Pin 1 is not connected and not drawn.; Published: 21-Mar-2003; DatasheetDocument: Oct-1999; PackageDocument: Sep-2001; PackageReference: SOT-23; Publisher: Altium Limited; ComponentLink1Description: Manufacturer Link; ComponentLink1URL: http://www.infineon.com/; ComponentLink2Description: Datasheet; ComponentLink2URL: http://www.infineon.com/upload/Document/cmc_upload/documents/009/401/bal74_bar74series_1.pdf
D?#4-D?#7 = LED0: Typical INFRARED GaAs LED; Published: 8-Jun-2000; LatestRevisionDate: 08-Jul-2005; LatestRevisionNote: Mech Layer 1 removed.; PackageReference: LED-0; Publisher: Altium Limited
J1 = 09 03 264 2824: Eurocard DIN 41612, Type C, 64 Position, Rows a+c, Performance level 1, Female, Lead 2.9 mm, Pitch 2.54 mm; DrillSize: Corresponds to nominal value.; Published: 6-Oct-2005; DatasheetDocument: 02-Jun-2003; PackageDocument: 19-Feb-2002; PackageReference: 0903264x824; Publisher: Altium Limited; ComponentLink1Description: Manufacturer Link; ComponentLink1URL: http://www.harting.com/; ComponentLink2Description: Packaging Specification; ComponentLink2URL: http://www.harkis.harting.com/_gds/pdf/TB_0903264x824_BL01_R30815.pdf
J?#1 J?#2 = D Connector 25: Receptacle Assembly, 25 Position, Right Angle; PackageDocument: U; Positions: 25; Published: 15-Jun-2001; LatestRevisionDate: 17-Jul-2002; LatestRevisionNote: Re-released for DXP Platform.; DatasheetDocument: 19-Mar-1999; PackageReference: 787202; Publisher: Altium Limited; Orientation: Right Angle; Gender: Receptacle
P?#1 = Header 7X2: Header, 7-Pin, Dual row; LatestRevisionDate: 17-Jul-2002; LatestRevisionNote: Re-released for DXP Platform.; Publisher: Altium Limited
P?#2 = Header 20X2: Header, 20-Pin, Dual row; LatestRevisionDate: 17-Jul-2002; LatestRevisionNote: Re-released for DXP Platform.; Publisher: Altium Limited
Q?#1 = BCW72: SOT23 NPN Planar Small Signal Transistor; Published: 8-Jun-2000; LatestRevisionDate: 17-Jul-2002; LatestRevisionNote: Re-released for DXP Platform.; DatasheetVersion: Feb-1995; PackageVersion: 1996; PackageReference: SOT23; Publisher: Altium Limited; PackageDescription: SOT-23; 3 Leads; Body 3.1 x 2.5 mm, inc. leads (LxW max), Alternate Lead Configuration; ComponentLink1Description: Manufacturer Link; ComponentLink1URL: http://www.zetex.com/; ComponentLink2Description: Datasheet; ComponentLink2URL: www.zetex.com/3.0/pdf/BCW71.pdf
Q?#2 Q?#3 = BC857B: PNP General-purpose Transistor; Published: 17-Sep-2003; LatestRevisionDate: 12-Dec-2006; LatestRevisionNote: IPC-7351 Footprint Added.; DatasheetVersion: 4-Feb-2002; PackageVersion: May-1999; PackageReference: SOT23; Publisher: Altium Limited; PackageDescription: 3-Pin SOT-23 Package 0.95 mm Pitch, 2.3 mm Lead Span; ComponentLink1Description: Manufacturer Link; ComponentLink1URL: http://www.semiconductors.philips.com/; ComponentLink2Description: Datasheet; ComponentLink2URL: http://www.semiconductors.philips.com/acrobat/datasheets/BC856_BC857_BC858_6.pdf
Q?#4 = BCV47: NPN Darlington Transistor; Published: 17-Sep-2003; LatestRevisionDate: 12-Dec-2006; LatestRevisionNote: IPC-7351 Footprint Added.; DatasheetVersion: 8-Apr-1999; PackageVersion: May-1999; PackageReference: SOT23; Publisher: Altium Limited; PackageDescription: 3-Pin SOT-23 Package 0.95 mm Pitch, 2.3 mm Lead Span; ComponentLink1Description: Manufacturer Link; ComponentLink1URL: http://www.semiconductors.philips.com/; ComponentLink2Description: Datasheet; ComponentLink2URL: http://www.semiconductors.philips.com/acrobat/datasheets/BCV27_BCV47_5.pdf
R?#1-R?#4 R?#7 R?#8 R?#16 R?#22 R?#24-R?#28 R?#61 R?#62 = Res Semi: Semiconductor Resistor; Published: 8-Jun-2000; LatestRevisionDate: 17-Jul-2002; LatestRevisionNote: Re-released for DXP Platform.; Publisher: Altium Limited
  R?#1 R?#2 R?#7 R?#8 R?#16 R?#22 R?#24-R?#28 R?#61 R?#62: PackageReference: AXIAL-0.5
R?#5 R?#6 R?#9-R?#15 R?#17-R?#21 R?#23 R?#29-R?#60 R?#63-R?#70 = Res Semi: Semiconductor Resistor; Value: 1K; Published: 8-Jun-2000; LatestRevisionDate: 17-Jul-2002; LatestRevisionNote: Re-released for DXP Platform.; Publisher: Altium Limited
  R?#6 R?#9 R?#10 R?#12-R?#15 R?#18-R?#21 R?#29-R?#60 R?#63-R?#70: PackageReference: AXIAL-0.5
S? = SW-SPDT: SPDT Subminiature Toggle Switch, Right Angle Mounting, Vertical Actuation; Published: 24-Mar-1999; LatestRevisionDate: 17-Dec-2003; LatestRevisionNote: Schematic revised, PCB Footprint replaced.; DatasheetDocument: 05-Dec-2000; PackageReference: TL36WW15050; Publisher: Altium Limited; ComponentLink1Description: Manufacturer Link; ComponentLink1URL: http://www.apem.com
U?#1 U?#30 = SN74HC173D: 4-Bit D-Type Register with 3-State Outputs; ComponentAvailability: Obsolete; Published: 8-Jun-2000; LatestRevisionDate: 13-Apr-2006; LatestRevisionNote: IPC-7351 Footprint Added.; DatasheetVersion: Sep-1987; PackageVersion: Jan-1998; PackageReference: D016; Publisher: Altium Limited; PackageDescription: 16-Pin Small Outline Integrated Circuit 1.27 mm Pitch; Code_IPC: SOIC127P600-16; ComponentLink1Description: Manufacturer Link; ComponentLink1URL: http://www.ti.com/; ComponentLink2Description: Discontinuation Notice; ComponentLink2URL: http://focus.ti.com/docs/prod/folders/print/sn74hc173.html
U?#2 = SN74HC540DW: Octal Buffer and Line Driver with 3-State Outputs; Published: 8-Jun-2000; LatestRevisionDate: 13-Apr-2006; LatestRevisionNote: IPC-7351 Footprint Added.; DatasheetVersion: May-1997; PackageVersion: Mar-2000; PackageReference: DW020; Publisher: Altium Limited; PackageDescription: 20-Pin Plastic Small Outline Integrated Circuit 1.27 mm Pitch; Code_JEDEC: MS-013; Code_IPC: SOIC127P1030-20; ComponentLink1Description: Manufacturer Link; ComponentLink1URL: http://www.ti.com/; ComponentLink2Description: Datasheet; ComponentLink2URL: http://www-s.ti.com/sc/ds/sn74hc540.pdf
U?#4 U?#5 U?#11 U?#12 U?#40 U?#41 U?#47 U?#48 = 74AC11032D: Quadruple 2-Input Positive-OR Gate; Published: 8-Jun-2000; LatestRevisionDate: 13-Apr-2006; LatestRevisionNote: IPC-7351 Footprint Added.; DatasheetVersion: Apr-1996; PackageVersion: Jan-1998; PackageReference: D016; Publisher: Altium Limited; PackageDescription: 16-Pin Small Outline Integrated Circuit 1.27 mm Pitch; Code_IPC: SOIC127P600-16; ComponentLink1Description: Manufacturer Link; ComponentLink1URL: http://www.ti.com/; ComponentLink2Description: Datasheet; ComponentLink2URL: http://www-s.ti.com/sc/ds/74ac11032.pdf; ComponentLink3Description: Packaging Specification; ComponentLink3URL: http://focus.ti.com/lit/ml/mpds178/mpds178.pdf
U?#6 U?#7 U?#13 U?#14 = SN74ALS03BD: Quadruple 2-Input Positive-NAND Buffer with Open-Collector Outputs; Published: 8-Jun-2000; LatestRevisionDate: 13-Apr-2006; LatestRevisionNote: IPC-7351 Footprint Added.; DatasheetVersion: Dec-1994; PackageVersion: Jan-1998; PackageReference: D014; Publisher: Altium Limited; PackageDescription: 14-Pin Small Outline Integrated Circuit 1.27 mm Pitch; Code_IPC: SOIC127P600-14; ComponentLink1Description: Manufacturer Link; ComponentLink1URL: http://www.ti.com/; ComponentLink2Description: Datasheet; ComponentLink2URL: http://www-s.ti.com/sc/ds/sn54als03b.pdf; ComponentLink3Description: Packaging Specification; ComponentLink3URL: http://focus.ti.com/lit/ml/mpds177/mpds177.pdf
U?#8-U?#10 U?#15-U?#17 = SN74AHC04D: Hex Inverter; Published: 8-Jun-2000; LatestRevisionDate: 13-Apr-2006; LatestRevisionNote: IPC-7351 Footprint Added.; DatasheetVersion: Jun-1998; PackageVersion: Jan-1998; PackageReference: D014; Publisher: Altium Limited; PackageDescription: 14-Pin Small Outline Integrated Circuit 1.27 mm Pitch; Code_IPC: SOIC127P600-14; ComponentLink1Description: Manufacturer Link; ComponentLink1URL: http://www.ti.com/; ComponentLink2Description: Datasheet; ComponentLink2URL: http://www-s.ti.com/sc/ds/sn74ahc04.pdf; ComponentLink3Description: Packaging Specification; ComponentLink3URL: http://focus.ti.com/lit/ml/mpds177/mpds177.pdf
U?#18 = DP8573AV: Real Time Clock (RTC); Manufacturer: National Semiconductor; CompType: Interface IC; PackageTopMarking: NSUZXYYTT*DP8573AV; Published: 27-Nov-2008; DatasheetVersion: May-1993; PackageVersion: revK, Dec-1993; PackageReference: V28A; Publisher: Altium Limited; PackageDescription: Plastic Chip Carrier, Sq., .050mil Lead Pitch, 28 Lead; PartNumber: DP8573AV; RoHS: O; PinCount: 28; DigiKeyPartNumber: DP8573AV-ND; Code_IPC: PLCC-28; ComponentLink1Description: DP8573A Datasheet; ComponentLink1URL: http://www.national.com/ds/DP/DP8573A.pdf; ComponentLink2Description: DP8573A Web Page; ComponentLink2URL: http://www.national.com/pf/DP/DP8573A.html; ComponentLink3Description: V28A Package Page; ComponentLink3URL: http://www.national.com/packaging/folders/v28a.html
U?#19-U?#21 = 74AC11373DW: Octal Transparent D-Type Latch with 3-State Outputs; ComponentAvailability: Obsolete; Published: 8-Jun-2000; LatestRevisionDate: 13-Apr-2006; LatestRevisionNote: IPC-7351 Footprint Added.; DatasheetVersion: Apr-1996; PackageVersion: Mar-2000; PackageReference: DW024; Publisher: Altium Limited; PackageDescription: 24-Pin Plastic Small Outline Integrated Circuit 1.27 mm Pitch; Code_JEDEC: MS-013; ComponentLink1Description: Manufacturer Link; ComponentLink1URL: http://www.ti.com/; ComponentLink2Description: Datasheet; ComponentLink2URL: http://www-s.ti.com/sc/ds/74ac11373.pdf
U?#22 U?#27 = 74AC11074D: Dual Positive-Edge-Triggered D-Type Flip-Flop with Clear and Preset; Published: 8-Jun-2000; LatestRevisionDate: 13-Apr-2006; LatestRevisionNote: IPC-7351 Footprint Added.; DatasheetVersion: Apr-1996; PackageVersion: Jan-1998; PackageReference: D014; Publisher: Altium Limited; PackageDescription: 14-Pin Small Outline Integrated Circuit 1.27 mm Pitch; Code_IPC: SOIC127P600-14; ComponentLink1Description: Manufacturer Link; ComponentLink1URL: http://www.ti.com/; ComponentLink2Description: Datasheet; ComponentLink2URL: http://www-s.ti.com/sc/ds/74ac11074.pdf
U?#32 = 74AC11245DW: Octal Bus Transceiver with 3-State Outputs; ComponentAvailability: Obsolete; Published: 8-Jun-2000; LatestRevisionDate: 13-Apr-2006; LatestRevisionNote: IPC-7351 Footprint Added.; DatasheetVersion: Apr-1996; PackageVersion: Mar-2000; PackageReference: DW024; Publisher: Altium Limited; PackageDescription: 24-Pin Plastic Small Outline Integrated Circuit 1.27 mm Pitch; Code_JEDEC: MS-013; ComponentLink1Description: Manufacturer Link; ComponentLink1URL: http://www.ti.com/; ComponentLink2Description: Datasheet; ComponentLink2URL: http://www-s.ti.com/sc/ds/74ac11245.pdf
U?#33 U?#34 U?#38 U?#39 = 6N136: Optoacoplador
U?#42 U?#43 = UA9637ACP: Dual Differential Line Receiver; Published: 15-May-2002; LatestRevisionDate: 04-Mar-2005; LatestRevisionNote: Stylized 3D Model Added.; DatasheetVersion: Nov-1986; PackageVersion: Jun-1999; PackageReference: P008; Publisher: Altium Limited; PackageDescription: DIP; 8 Leads; Row Spacing 7.62 mm; Pitch 2.54 mm; Code_JEDEC: MO-001-AN; ComponentLink1Description: Manufacturer Link; ComponentLink1URL: http://www.ti.com/; ComponentLink2Description: Datasheet; ComponentLink2URL: http://www-s.ti.com/sc/ds/ua9637a.pdf
U?#44 U?#45 = UA9638CP: Dual High-Speed Differential Line Driver; Published: 15-May-2002; LatestRevisionDate: 04-Mar-2005; LatestRevisionNote: Stylized 3D Model Added.; DatasheetVersion: Sep-1986; PackageVersion: Jun-1999; PackageReference: P008; Publisher: Altium Limited; PackageDescription: DIP; 8 Leads; Row Spacing 7.62 mm; Pitch 2.54 mm; Code_JEDEC: MO-001-AN; ComponentLink1Description: Manufacturer Link; ComponentLink1URL: http://www.ti.com/; ComponentLink2Description: Datasheet; ComponentLink2URL: http://www-s.ti.com/sc/ds/ua9638.pdf
U?#46 = UPD72001-11
Y?#1 = ECS-10-13-1: Crystal Oscillator; Published: 17-Jul-2002; DatasheetDocument: 18-Apr-2000; PackageReference: HC-49U; Publisher: Altium Limited; ComponentLink1Description: Manufacturer Link; ComponentLink1URL: http://www.ecsxtal.com/; ComponentLink2Description: Datasheet; ComponentLink2URL: http://www.ecsxtal.com/pdf2/HC49U.PDF
Y?#2 = ECS-35-17-7M: Crystal Oscillator; Published: 17-Jul-2002; DatasheetDocument: 18-Apr-2000; PackageReference: ECX-3M; Publisher: Altium Limited; ComponentLink1Description: Manufacturer Link; ComponentLink1URL: http://www.ecsxtal.com/
P?#3 = Plug: LatestRevisionDate: 17-Jul-2002; LatestRevisionNote: Re-released for DXP Platform.; Publisher: Altium Limited